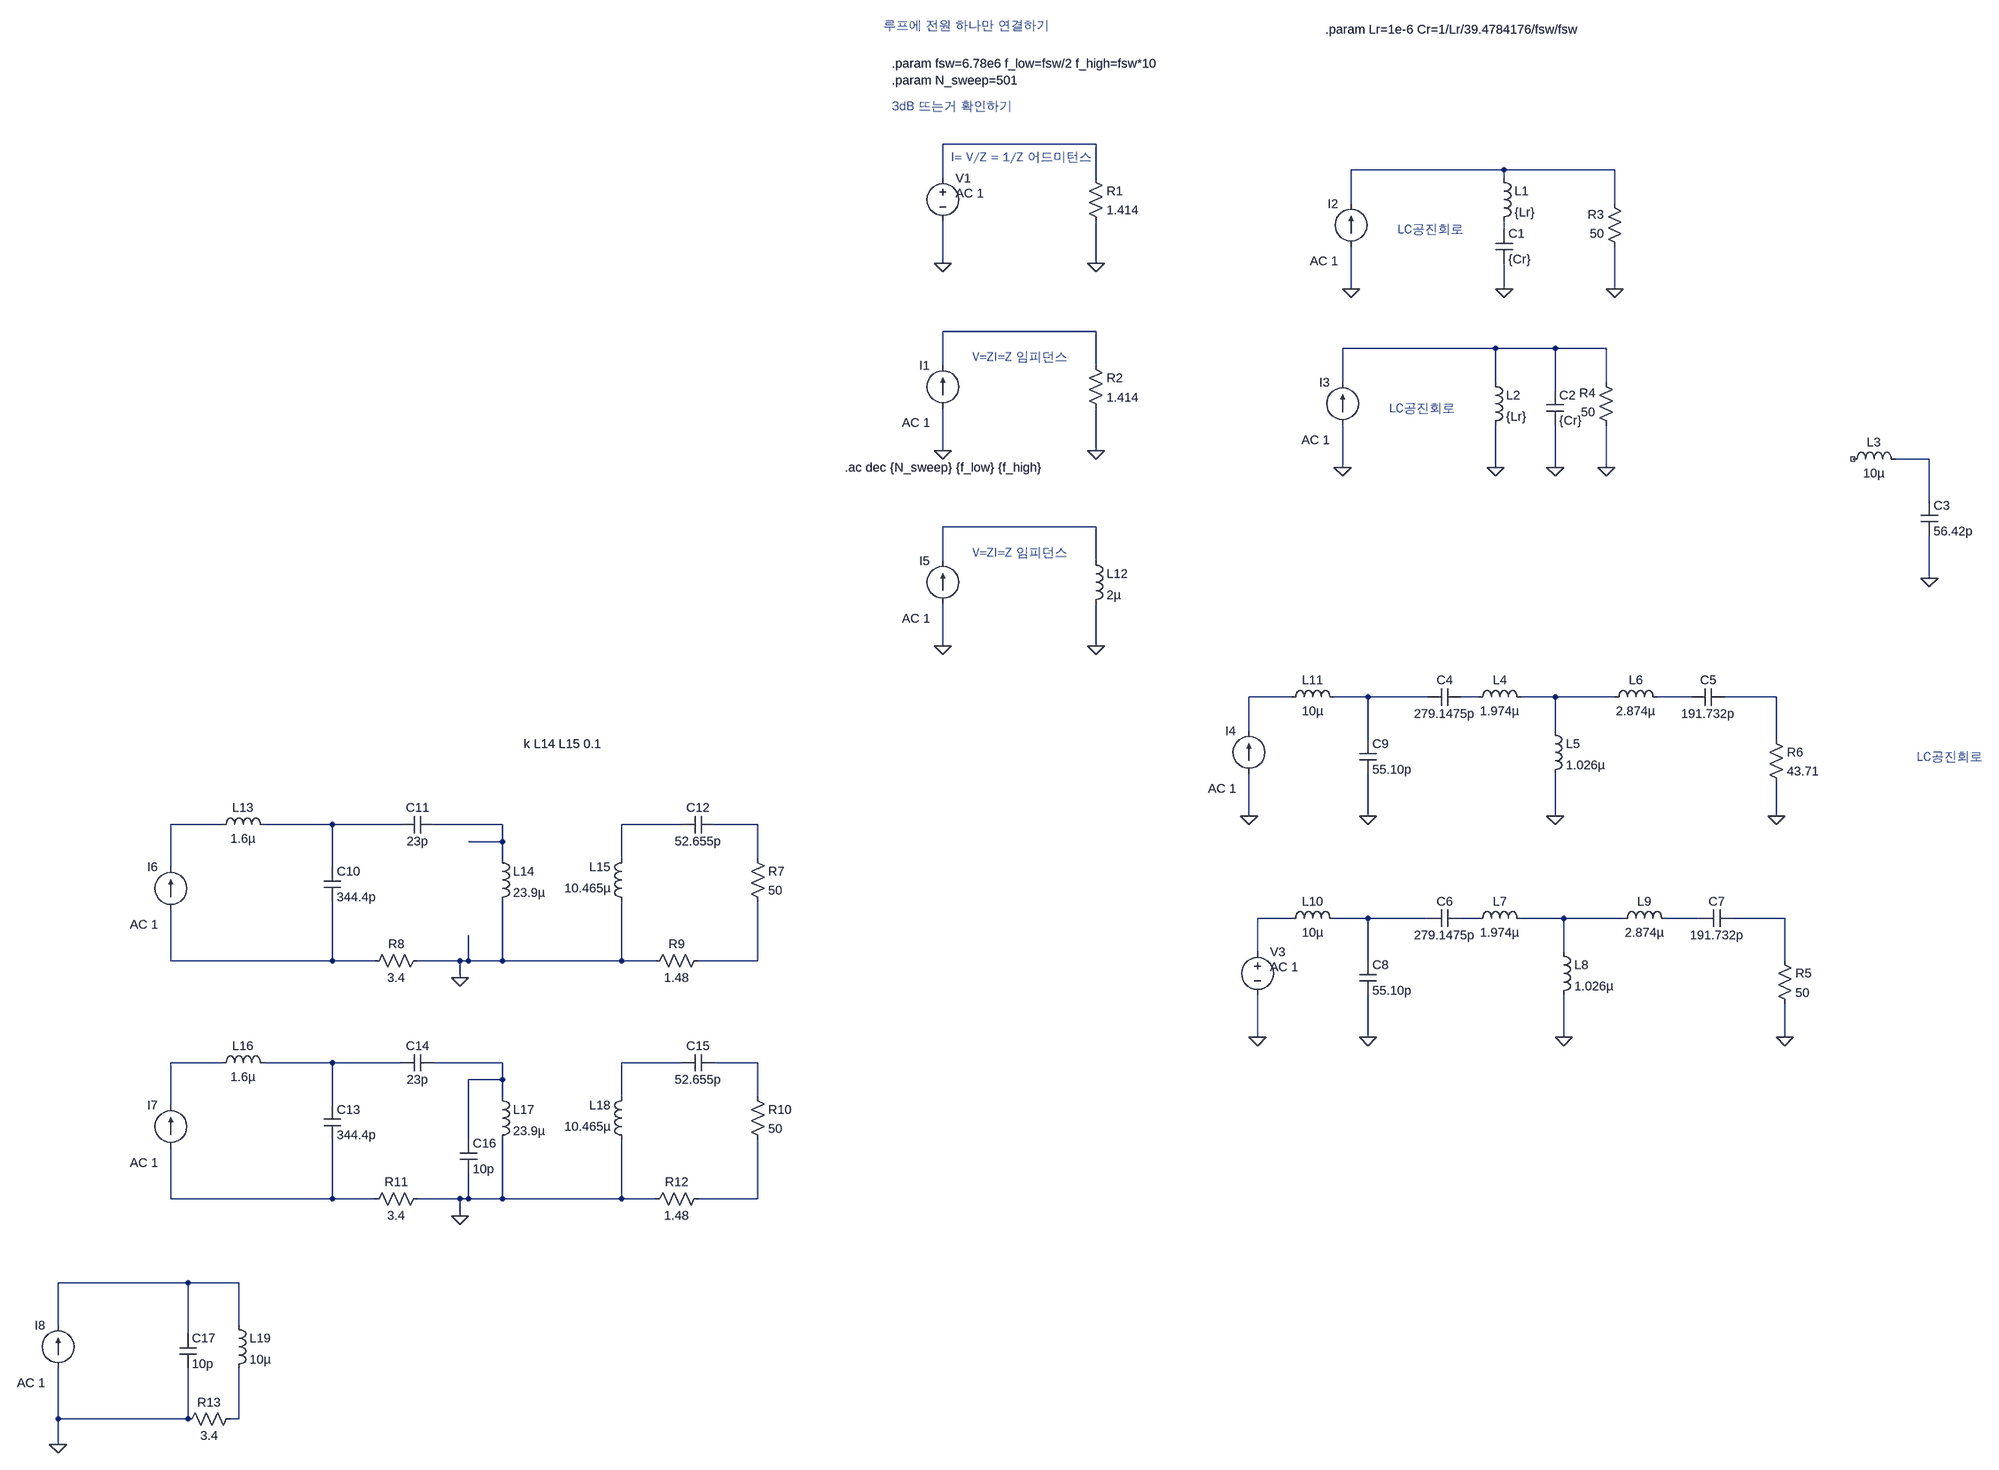
[diagram p0: schematic AC해석예제.asc]
AC해석예제.asc, the LTspice schematic file:
Version 4.1
SHEET 1 2156 2772
WIRE 336 64 48 64
WIRE 1104 112 816 112
WIRE 1312 112 1104 112
WIRE 48 128 48 64
WIRE 336 128 336 64
WIRE 1104 128 1104 112
WIRE 816 176 816 112
WIRE 1312 176 1312 112
WIRE 1104 224 1104 208
WIRE 48 288 48 208
WIRE 336 288 336 208
WIRE 816 336 816 256
WIRE 1104 336 1104 288
WIRE 1312 336 1312 256
WIRE 336 416 48 416
WIRE 1088 448 800 448
WIRE 1200 448 1088 448
WIRE 1296 448 1200 448
WIRE 48 480 48 416
WIRE 336 480 336 416
WIRE 800 512 800 448
WIRE 1088 512 1088 448
WIRE 1296 512 1296 448
WIRE 1200 528 1200 448
WIRE 48 640 48 560
WIRE 336 640 336 560
WIRE 1904 656 1840 656
WIRE 800 672 800 592
WIRE 1088 672 1088 592
WIRE 1200 672 1200 592
WIRE 1296 672 1296 592
WIRE 1904 736 1904 656
WIRE 336 784 48 784
WIRE 48 848 48 784
WIRE 336 848 336 784
WIRE 1904 880 1904 800
WIRE 48 1008 48 928
WIRE 336 1008 336 928
WIRE 704 1104 624 1104
WIRE 848 1104 784 1104
WIRE 960 1104 848 1104
WIRE 1056 1104 1024 1104
WIRE 1200 1104 1136 1104
WIRE 1312 1104 1200 1104
WIRE 1456 1104 1392 1104
WIRE 1616 1104 1520 1104
WIRE 624 1168 624 1104
WIRE 1200 1168 1200 1104
WIRE 848 1184 848 1104
WIRE 1616 1184 1616 1104
WIRE 624 1328 624 1248
WIRE 848 1328 848 1248
WIRE 1200 1328 1200 1248
WIRE 1616 1328 1616 1264
WIRE -1600 1344 -1696 1344
WIRE -1392 1344 -1520 1344
WIRE -1264 1344 -1392 1344
WIRE -1072 1344 -1200 1344
WIRE -736 1344 -848 1344
WIRE -592 1344 -672 1344
WIRE -1072 1376 -1072 1344
WIRE -1072 1376 -1136 1376
WIRE -1072 1408 -1072 1376
WIRE -848 1408 -848 1344
WIRE -592 1408 -592 1344
WIRE -1696 1424 -1696 1344
WIRE -1392 1424 -1392 1344
WIRE 704 1520 640 1520
WIRE 848 1520 784 1520
WIRE 960 1520 848 1520
WIRE 1056 1520 1024 1520
WIRE 1216 1520 1136 1520
WIRE 1328 1520 1216 1520
WIRE 1472 1520 1408 1520
WIRE 1632 1520 1536 1520
WIRE 640 1584 640 1520
WIRE 1216 1584 1216 1520
WIRE -1696 1600 -1696 1504
WIRE -1392 1600 -1392 1488
WIRE -1392 1600 -1696 1600
WIRE -1312 1600 -1392 1600
WIRE -1152 1600 -1232 1600
WIRE -1136 1600 -1136 1552
WIRE -1136 1600 -1152 1600
WIRE -1072 1600 -1072 1488
WIRE -1072 1600 -1136 1600
WIRE -848 1600 -848 1488
WIRE -848 1600 -1072 1600
WIRE -784 1600 -848 1600
WIRE -592 1600 -592 1488
WIRE -592 1600 -704 1600
WIRE 848 1600 848 1520
WIRE 1632 1600 1632 1520
WIRE -1152 1632 -1152 1600
WIRE 640 1744 640 1664
WIRE 848 1744 848 1664
WIRE 1216 1744 1216 1664
WIRE 1632 1744 1632 1680
WIRE -1600 1792 -1696 1792
WIRE -1392 1792 -1520 1792
WIRE -1264 1792 -1392 1792
WIRE -1072 1792 -1200 1792
WIRE -736 1792 -848 1792
WIRE -592 1792 -672 1792
WIRE -1072 1824 -1072 1792
WIRE -1072 1824 -1136 1824
WIRE -1072 1856 -1072 1824
WIRE -848 1856 -848 1792
WIRE -592 1856 -592 1792
WIRE -1696 1872 -1696 1792
WIRE -1392 1872 -1392 1792
WIRE -1136 1936 -1136 1824
WIRE -1696 2048 -1696 1952
WIRE -1392 2048 -1392 1936
WIRE -1392 2048 -1696 2048
WIRE -1312 2048 -1392 2048
WIRE -1152 2048 -1232 2048
WIRE -1136 2048 -1136 2000
WIRE -1136 2048 -1152 2048
WIRE -1072 2048 -1072 1936
WIRE -1072 2048 -1136 2048
WIRE -848 2048 -848 1936
WIRE -848 2048 -1072 2048
WIRE -784 2048 -848 2048
WIRE -592 2048 -592 1936
WIRE -592 2048 -704 2048
WIRE -1152 2080 -1152 2048
WIRE -1664 2448 -1920 2448
WIRE -1568 2448 -1664 2448
WIRE -1920 2528 -1920 2448
WIRE -1568 2528 -1568 2448
WIRE -1664 2544 -1664 2448
WIRE -1920 2704 -1920 2608
WIRE -1664 2704 -1664 2608
WIRE -1664 2704 -1920 2704
WIRE -1568 2704 -1568 2608
WIRE -1568 2704 -1584 2704
WIRE -1920 2752 -1920 2704
FLAG 48 288 0
FLAG 48 640 0
FLAG 336 640 0
FLAG 336 288 0
FLAG 816 336 0
FLAG 1104 336 0
FLAG 1312 336 0
FLAG 800 672 0
FLAG 1088 672 0
FLAG 1296 672 0
FLAG 1200 672 0
FLAG 624 1328 0
FLAG 1904 880 0
FLAG 1200 1328 0
FLAG 1616 1328 0
FLAG 640 1744 0
FLAG 1216 1744 0
FLAG 1632 1744 0
FLAG 848 1744 0
FLAG 848 1328 0
FLAG 48 1008 0
FLAG 336 1008 0
FLAG -1152 1632 0
FLAG -1152 2080 0
FLAG -1920 2752 0
SYMBOL voltage 48 112 R0
WINDOW 123 24 44 Left 2
WINDOW 39 0 0 Left 0
SYMATTR Value2 AC 1
SYMATTR InstName V1
SYMATTR Value ""
SYMBOL res 320 112 R0
SYMATTR InstName R1
SYMATTR Value 1.414
SYMBOL res 320 464 R0
SYMATTR InstName R2
SYMATTR Value 1.414
SYMBOL current 48 560 R180
WINDOW 0 24 80 Left 2
WINDOW 3 24 0 Left 2
WINDOW 123 24 -28 Left 2
WINDOW 39 0 0 Left 0
SYMATTR InstName I1
SYMATTR Value ""
SYMATTR Value2 AC 1
SYMBOL current 816 256 R180
WINDOW 0 24 80 Left 2
WINDOW 3 24 0 Left 2
WINDOW 123 24 -28 Left 2
WINDOW 39 0 0 Left 0
SYMATTR InstName I2
SYMATTR Value ""
SYMATTR Value2 AC 1
SYMBOL ind 1088 112 R0
SYMATTR InstName L1
SYMATTR Value {Lr}
SYMATTR SpiceLine Rser=1m
SYMBOL cap 1088 224 R0
SYMATTR InstName C1
SYMATTR Value {Cr}
SYMBOL res 1328 272 R180
WINDOW 0 36 76 Left 2
WINDOW 3 36 40 Left 2
SYMATTR InstName R3
SYMATTR Value 50
SYMBOL current 800 592 R180
WINDOW 0 24 80 Left 2
WINDOW 3 24 0 Left 2
WINDOW 123 24 -28 Left 2
WINDOW 39 0 0 Left 0
SYMATTR InstName I3
SYMATTR Value ""
SYMATTR Value2 AC 1
SYMBOL ind 1072 496 R0
SYMATTR InstName L2
SYMATTR Value {Lr}
SYMATTR SpiceLine Rser=1m
SYMBOL cap 1184 528 R0
SYMATTR InstName C2
SYMATTR Value {Cr}
SYMBOL res 1312 608 R180
WINDOW 0 36 76 Left 2
WINDOW 3 36 40 Left 2
SYMATTR InstName R4
SYMATTR Value 50
SYMBOL current 624 1248 R180
WINDOW 0 24 80 Left 2
WINDOW 3 24 0 Left 2
WINDOW 123 24 -28 Left 2
WINDOW 39 0 0 Left 0
SYMATTR InstName I4
SYMATTR Value ""
SYMATTR Value2 AC 1
SYMBOL ind 1744 672 R270
WINDOW 0 32 56 VTop 2
WINDOW 3 5 56 VBottom 2
SYMATTR InstName L3
SYMATTR Value 10µ
SYMATTR SpiceLine Rser=1m
SYMBOL cap 1888 736 R0
SYMATTR InstName C3
SYMATTR Value 56.42p
SYMBOL ind 1184 1152 R0
SYMATTR InstName L5
SYMATTR Value 1.026µ
SYMATTR SpiceLine Rser=1m
SYMBOL ind 1296 1120 R270
WINDOW 0 32 56 VTop 2
WINDOW 3 5 56 VBottom 2
SYMATTR InstName L6
SYMATTR Value 2.874µ
SYMATTR SpiceLine Rser=1m
SYMBOL cap 1520 1088 R90
WINDOW 0 0 32 VBottom 2
WINDOW 3 32 32 VTop 2
SYMATTR InstName C5
SYMATTR Value 191.732p
SYMBOL ind 1040 1536 R270
WINDOW 0 32 56 VTop 2
WINDOW 3 5 56 VBottom 2
SYMATTR InstName L7
SYMATTR Value 1.974µ
SYMATTR SpiceLine Rser=1m
SYMBOL ind 1200 1568 R0
SYMATTR InstName L8
SYMATTR Value 1.026µ
SYMATTR SpiceLine Rser=1m
SYMBOL ind 1312 1536 R270
WINDOW 0 32 56 VTop 2
WINDOW 3 5 56 VBottom 2
SYMATTR InstName L9
SYMATTR Value 2.874µ
SYMATTR SpiceLine Rser=1m
SYMBOL cap 1536 1504 R90
WINDOW 0 0 32 VBottom 2
WINDOW 3 32 32 VTop 2
SYMATTR InstName C7
SYMATTR Value 191.732p
SYMBOL res 1616 1584 R0
SYMATTR InstName R5
SYMATTR Value 50
SYMBOL voltage 640 1568 R0
WINDOW 123 24 44 Left 2
WINDOW 39 0 0 Left 0
SYMATTR Value2 AC 1
SYMATTR InstName V3
SYMATTR Value ""
SYMBOL cap 1024 1504 R90
WINDOW 0 0 32 VBottom 2
WINDOW 3 32 32 VTop 2
SYMATTR InstName C6
SYMATTR Value 279.1475p
SYMBOL ind 688 1536 R270
WINDOW 0 32 56 VTop 2
WINDOW 3 5 56 VBottom 2
SYMATTR InstName L10
SYMATTR Value 10µ
SYMATTR SpiceLine Rser=1m
SYMBOL cap 832 1600 R0
SYMATTR InstName C8
SYMATTR Value 55.10p
SYMBOL ind 1040 1120 R270
WINDOW 0 32 56 VTop 2
WINDOW 3 5 56 VBottom 2
SYMATTR InstName L4
SYMATTR Value 1.974µ
SYMATTR SpiceLine Rser=1m
SYMBOL cap 1024 1088 R90
WINDOW 0 0 32 VBottom 2
WINDOW 3 32 32 VTop 2
SYMATTR InstName C4
SYMATTR Value 279.1475p
SYMBOL ind 688 1120 R270
WINDOW 0 32 56 VTop 2
WINDOW 3 5 56 VBottom 2
SYMATTR InstName L11
SYMATTR Value 10µ
SYMATTR SpiceLine Rser=1m
SYMBOL cap 832 1184 R0
SYMATTR InstName C9
SYMATTR Value 55.10p
SYMBOL res 1600 1168 R0
SYMATTR InstName R6
SYMATTR Value 43.71
SYMBOL current 48 928 R180
WINDOW 0 24 80 Left 2
WINDOW 3 24 0 Left 2
WINDOW 123 24 -28 Left 2
WINDOW 39 0 0 Left 0
SYMATTR InstName I5
SYMATTR Value ""
SYMATTR Value2 AC 1
SYMBOL ind 320 832 R0
SYMATTR InstName L12
SYMATTR Value 2µ
SYMATTR SpiceLine Rser=1m
SYMBOL current -1696 1504 R180
WINDOW 0 24 80 Left 2
WINDOW 3 24 0 Left 2
WINDOW 123 24 -28 Left 2
WINDOW 39 0 0 Left 0
SYMATTR InstName I6
SYMATTR Value ""
SYMATTR Value2 AC 1
SYMBOL ind -1616 1360 R270
WINDOW 0 32 56 VTop 2
WINDOW 3 5 56 VBottom 2
SYMATTR InstName L13
SYMATTR Value 1.6µ
SYMATTR SpiceLine Rser=1m
SYMBOL cap -1408 1424 R0
SYMATTR InstName C10
SYMATTR Value 344.4p
SYMBOL cap -1200 1328 R90
WINDOW 0 0 32 VBottom 2
WINDOW 3 32 32 VTop 2
SYMATTR InstName C11
SYMATTR Value 23p
SYMBOL ind -1088 1392 R0
SYMATTR InstName L14
SYMATTR Value 23.9µ
SYMATTR Type ind
SYMATTR SpiceLine Rser=1m
SYMBOL ind -832 1504 R180
WINDOW 0 36 80 Left 2
WINDOW 3 36 40 Left 2
SYMATTR InstName L15
SYMATTR Value 10.465µ
SYMATTR Type ind
SYMATTR SpiceLine Rser=1m
SYMBOL cap -672 1328 R90
WINDOW 0 0 32 VBottom 2
WINDOW 3 32 32 VTop 2
SYMATTR InstName C12
SYMATTR Value 52.655p
SYMBOL res -608 1392 R0
SYMATTR InstName R7
SYMATTR Value 50
SYMBOL res -1216 1584 R90
WINDOW 0 0 56 VBottom 2
WINDOW 3 32 56 VTop 2
SYMATTR InstName R8
SYMATTR Value 3.4
SYMBOL res -688 1584 R90
WINDOW 0 0 56 VBottom 2
WINDOW 3 32 56 VTop 2
SYMATTR InstName R9
SYMATTR Value 1.48
SYMBOL current -1696 1952 R180
WINDOW 0 24 80 Left 2
WINDOW 3 24 0 Left 2
WINDOW 123 24 -28 Left 2
WINDOW 39 0 0 Left 0
SYMATTR InstName I7
SYMATTR Value ""
SYMATTR Value2 AC 1
SYMBOL ind -1616 1808 R270
WINDOW 0 32 56 VTop 2
WINDOW 3 5 56 VBottom 2
SYMATTR InstName L16
SYMATTR Value 1.6µ
SYMATTR SpiceLine Rser=1m
SYMBOL cap -1408 1872 R0
SYMATTR InstName C13
SYMATTR Value 344.4p
SYMBOL cap -1200 1776 R90
WINDOW 0 0 32 VBottom 2
WINDOW 3 32 32 VTop 2
SYMATTR InstName C14
SYMATTR Value 23p
SYMBOL ind -1088 1840 R0
SYMATTR InstName L17
SYMATTR Value 23.9µ
SYMATTR SpiceLine Rser=1m
SYMBOL ind -832 1952 R180
WINDOW 0 36 80 Left 2
WINDOW 3 36 40 Left 2
SYMATTR InstName L18
SYMATTR Value 10.465µ
SYMATTR SpiceLine Rser=1m
SYMBOL cap -672 1776 R90
WINDOW 0 0 32 VBottom 2
WINDOW 3 32 32 VTop 2
SYMATTR InstName C15
SYMATTR Value 52.655p
SYMBOL res -608 1840 R0
SYMATTR InstName R10
SYMATTR Value 50
SYMBOL res -1216 2032 R90
WINDOW 0 0 56 VBottom 2
WINDOW 3 32 56 VTop 2
SYMATTR InstName R11
SYMATTR Value 3.4
SYMBOL res -688 2032 R90
WINDOW 0 0 56 VBottom 2
WINDOW 3 32 56 VTop 2
SYMATTR InstName R12
SYMATTR Value 1.48
SYMBOL cap -1152 1936 R0
SYMATTR InstName C16
SYMATTR Value 10p
SYMBOL current -1920 2608 R180
WINDOW 0 24 80 Left 2
WINDOW 3 24 0 Left 2
WINDOW 123 24 -28 Left 2
WINDOW 39 0 0 Left 0
SYMATTR InstName I8
SYMATTR Value ""
SYMATTR Value2 AC 1
SYMBOL ind -1584 2512 R0
SYMATTR InstName L19
SYMATTR Value 10µ
SYMATTR SpiceLine Rser=1m
SYMBOL cap -1680 2544 R0
SYMATTR InstName C17
SYMATTR Value 10p
SYMBOL res -1568 2688 R90
WINDOW 0 0 56 VBottom 2
WINDOW 3 32 56 VTop 2
SYMATTR InstName R13
SYMATTR Value 3.4
TEXT -48 -88 Left 2 !.param fsw=6.78e6 f_low=fsw/2 f_high=fsw*10
TEXT -48 -56 Left 2 !.param N_sweep=501
TEXT -136 672 Left 2 !.ac dec {N_sweep} {f_low} {f_high}
TEXT -64 -160 Left 2 ;루프에 전원 하나만 연결하기
TEXT 104 464 Left 2 ;V=ZI=Z 임피던스
TEXT 64 88 Left 2 ;I= V/Z = 1/Z 어드미턴스
TEXT -48 -8 Left 2 ;3dB 뜨는거 확인하기
TEXT 904 224 Left 2 ;LC공진회로
TEXT 768 -152 Left 2 !.param Lr=1e-6 Cr=1/Lr/39.4784176/fsw/fsw
TEXT 888 560 Left 2 ;LC공진회로
TEXT 1880 1216 Left 2 ;LC공진회로
TEXT 104 832 Left 2 ;V=ZI=Z 임피던스
TEXT -1032 1192 Left 2 !k L14 L15 0.1

The netlist it stands for:
* AC해석예제.asc
V1 N001 0 AC 1
R1 N001 0 1.414
R2 N004 0 1.414
I1 0 N004 AC 1
I2 0 N002 AC 1
L1 N002 N003 {Lr} Rser=1m
C1 N003 0 {Cr}
R3 0 N002 50
I3 0 N005 AC 1
L2 N005 0 {Lr} Rser=1m
C2 N005 0 {Cr}
R4 0 N005 50
I4 0 N008 AC 1
L3 NC_01 N006 10µ Rser=1m
C3 N006 0 56.42p
L5 N011 0 1.026µ Rser=1m
L6 N011 N012 2.874µ Rser=1m
C5 N013 N012 191.732p
L7 N021 N022 1.974µ Rser=1m
L8 N022 0 1.026µ Rser=1m
L9 N022 N023 2.874µ Rser=1m
C7 N024 N023 191.732p
R5 N024 0 50
V3 N019 0 AC 1
C6 N021 N020 279.1475p
L10 N019 N020 10µ Rser=1m
C8 N020 0 55.10p
L4 N010 N011 1.974µ Rser=1m
C4 N010 N009 279.1475p
L11 N008 N009 10µ Rser=1m
C9 N009 0 55.10p
R6 N013 0 43.71
I5 0 N007 AC 1
L12 N007 0 2µ Rser=1m
I6 N025 N014 AC 1
L13 N014 N015 1.6µ Rser=1m
C10 N015 N025 344.4p
C11 N016 N015 23p
L14 N016 0 23.9µ Rser=1m
L15 0 N017 10.465µ Rser=1m
C12 N018 N017 52.655p
R7 N018 N026 50
R8 0 N025 3.4
R9 N026 0 1.48
I7 N032 N027 AC 1
L16 N027 N028 1.6µ Rser=1m
C13 N028 N032 344.4p
C14 N029 N028 23p
L17 N029 0 23.9µ Rser=1m
L18 0 N030 10.465µ Rser=1m
C15 N031 N030 52.655p
R10 N031 N033 50
R11 0 N032 3.4
R12 N033 0 1.48
C16 N029 0 10p
I8 0 N034 AC 1
L19 N034 N035 10µ Rser=1m
C17 N034 0 10p
R13 N035 0 3.4
.param fsw=6.78e6 f_low=fsw/2 f_high=fsw*10
.param N_sweep=501
.ac dec {N_sweep} {f_low} {f_high}
* 루프에 전원 하나만 연결하기
* V=ZI=Z 임피던스
* I= V/Z = 1/Z 어드미턴스
* 3dB 뜨는거 확인하기
* LC공진회로
.param Lr=1e-6 Cr=1/Lr/39.4784176/fsw/fsw
* LC공진회로
* LC공진회로
* V=ZI=Z 임피던스
k L14 L15 0.1
.backanno
.end